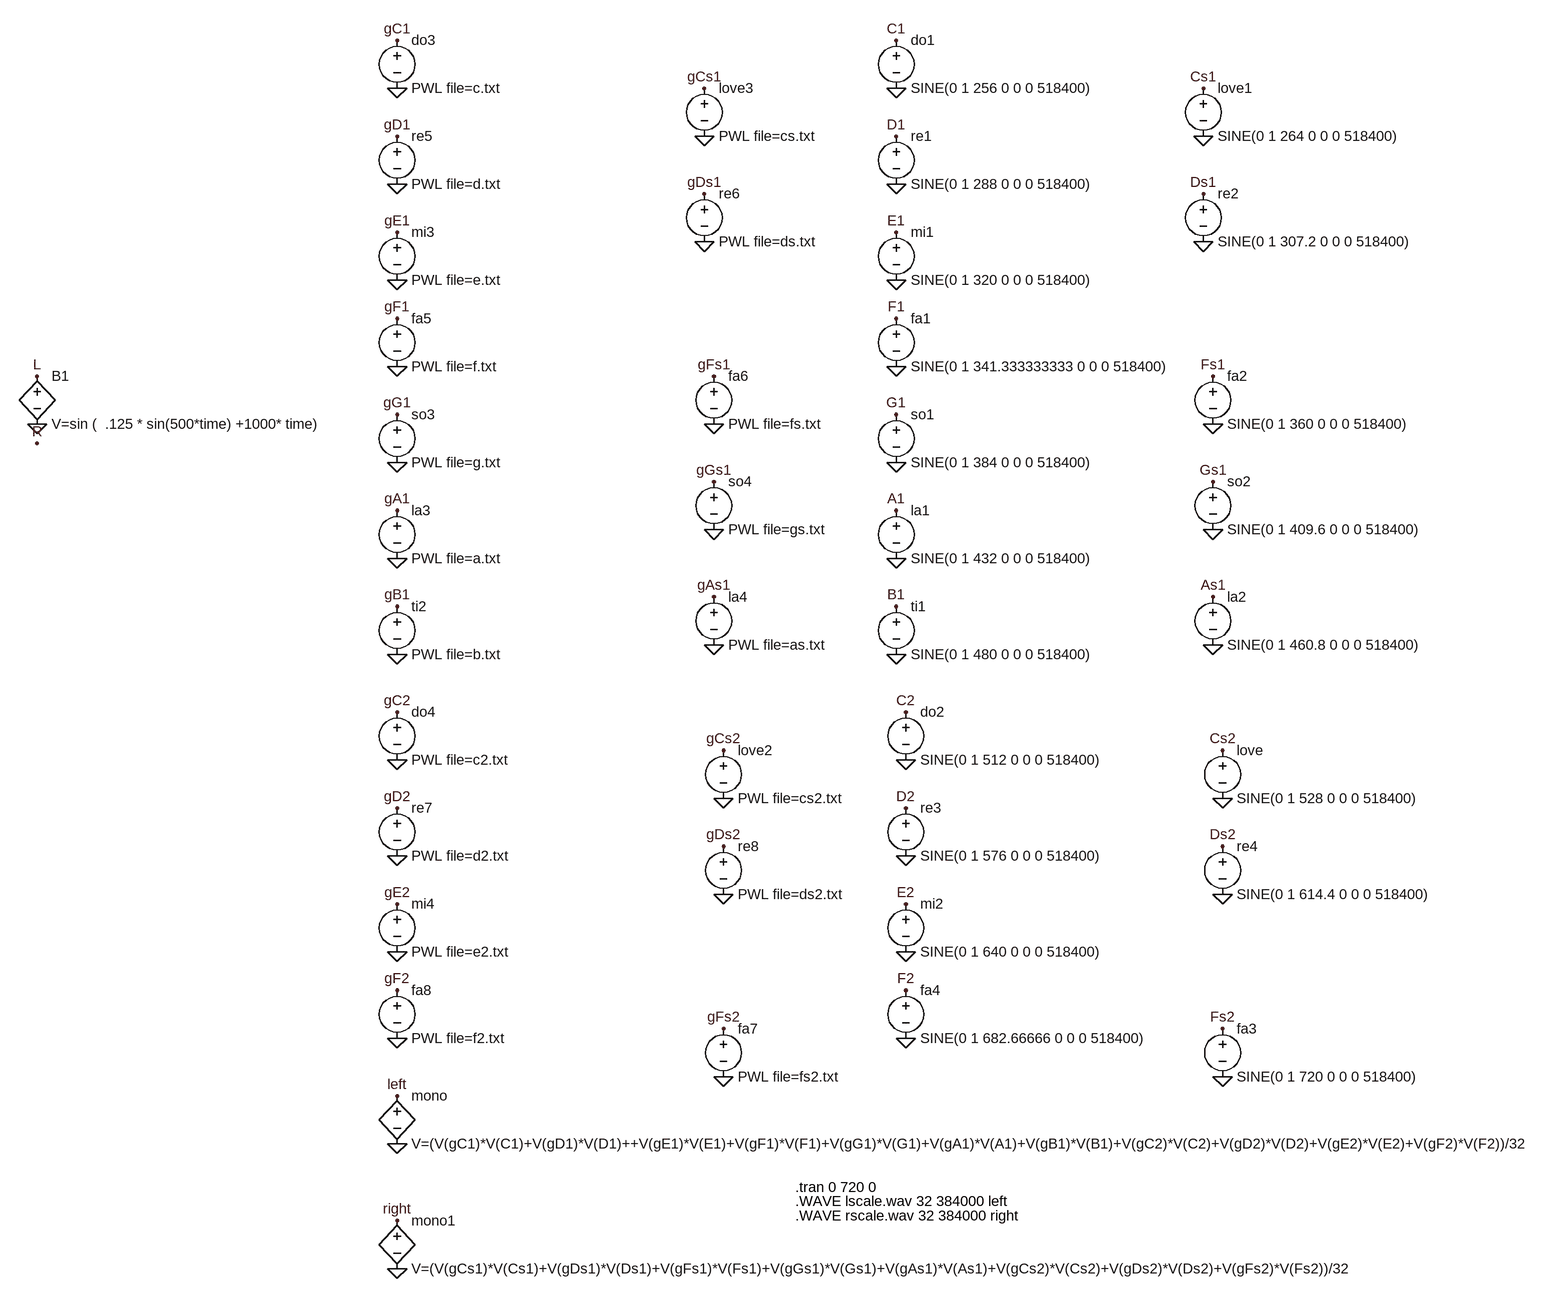
[diagram p0: schematic oneChord.asc]
oneChord.asc, the LTspice schematic file:
Version 4
SHEET 1 6640 1876
FLAG -1952 -992 0
FLAG -1952 -1072 C1
FLAG -1952 -912 D1
FLAG -1952 -672 0
FLAG -1952 -752 E1
FLAG -1952 -608 F1
FLAG -1952 -368 0
FLAG -1952 -448 G1
FLAG -1952 -288 A1
FLAG -1952 -48 0
FLAG -1952 -128 B1
FLAG -1952 -832 0
FLAG -1952 -528 0
FLAG -1952 -208 0
FLAG -1408 192 0
FLAG -1408 112 Cs2
FLAG -1440 -816 Ds1
FLAG -1440 -736 0
FLAG -1424 -512 Fs1
FLAG -1424 -432 0
FLAG -1424 -256 0
FLAG -1424 -336 Gs1
FLAG -1424 -144 As1
FLAG -1424 -64 0
FLAG -1440 -912 0
FLAG -1440 -992 Cs1
FLAG -1408 576 Fs2
FLAG -1408 656 0
FLAG -1936 128 0
FLAG -1936 48 C2
FLAG -1936 208 D2
FLAG -1936 448 0
FLAG -1936 368 E2
FLAG -1936 512 F2
FLAG -1936 288 0
FLAG -1936 592 0
FLAG -1408 272 Ds2
FLAG -1408 352 0
FLAG -2784 -992 0
FLAG -2784 -1072 gC1
FLAG -2784 -912 gD1
FLAG -2784 -672 0
FLAG -2784 -752 gE1
FLAG -2784 -608 gF1
FLAG -2784 -368 0
FLAG -2784 -448 gG1
FLAG -2784 -288 gA1
FLAG -2784 -48 0
FLAG -2784 -128 gB1
FLAG -2784 -832 0
FLAG -2784 -528 0
FLAG -2784 -208 0
FLAG -2240 192 0
FLAG -2240 112 gCs2
FLAG -2272 -816 gDs1
FLAG -2272 -736 0
FLAG -2256 -512 gFs1
FLAG -2256 -432 0
FLAG -2256 -256 0
FLAG -2256 -336 gGs1
FLAG -2256 -144 gAs1
FLAG -2256 -64 0
FLAG -2272 -912 0
FLAG -2272 -992 gCs1
FLAG -2240 576 gFs2
FLAG -2240 656 0
FLAG -2784 128 0
FLAG -2784 48 gC2
FLAG -2784 208 gD2
FLAG -2784 448 0
FLAG -2784 368 gE2
FLAG -2784 512 gF2
FLAG -2784 288 0
FLAG -2784 592 0
FLAG -2240 272 gDs2
FLAG -2240 352 0
FLAG -2784 768 0
FLAG -2784 688 left
FLAG -2784 976 0
FLAG -2784 896 right
FLAG -4176 -512 L
FLAG -4176 -432 0
FLAG -4176 -400 R
SYMBOL voltage -1952 -1088 R0
WINDOW 123 0 0 Left 0
WINDOW 39 0 0 Left 0
SYMATTR InstName do1
SYMATTR Value SINE(0 1 256 0 0 0 518400)
SYMBOL voltage -1952 -928 R0
WINDOW 123 0 0 Left 0
WINDOW 39 0 0 Left 0
SYMATTR InstName re1
SYMATTR Value SINE(0 1 288 0 0 0 518400)
SYMBOL voltage -1952 -768 R0
WINDOW 123 0 0 Left 0
WINDOW 39 0 0 Left 0
SYMATTR InstName mi1
SYMATTR Value SINE(0 1 320 0 0 0 518400)
SYMBOL voltage -1952 -624 R0
WINDOW 123 0 0 Left 0
WINDOW 39 0 0 Left 0
SYMATTR InstName fa1
SYMATTR Value SINE(0 1 341.333333333 0 0 0 518400)
SYMBOL voltage -1952 -464 R0
WINDOW 123 0 0 Left 0
WINDOW 39 0 0 Left 0
SYMATTR InstName so1
SYMATTR Value SINE(0 1 384 0 0 0 518400)
SYMBOL voltage -1952 -304 R0
WINDOW 123 0 0 Left 0
WINDOW 39 0 0 Left 0
SYMATTR InstName la1
SYMATTR Value SINE(0 1 432 0 0 0 518400)
SYMBOL voltage -1952 -144 R0
WINDOW 123 0 0 Left 0
WINDOW 39 0 0 Left 0
SYMATTR InstName ti1
SYMATTR Value SINE(0 1 480 0 0 0 518400)
SYMBOL voltage -1408 96 R0
WINDOW 123 0 0 Left 0
WINDOW 39 0 0 Left 0
SYMATTR InstName love
SYMATTR Value SINE(0 1 528 0 0 0 518400)
SYMBOL voltage -1440 -832 R0
WINDOW 123 0 0 Left 0
WINDOW 39 0 0 Left 0
SYMATTR InstName re2
SYMATTR Value SINE(0 1 307.2 0 0 0 518400)
SYMBOL voltage -1424 -528 R0
WINDOW 123 0 0 Left 0
WINDOW 39 0 0 Left 0
SYMATTR InstName fa2
SYMATTR Value SINE(0 1 360 0 0 0 518400)
SYMBOL voltage -1424 -352 R0
WINDOW 123 0 0 Left 0
WINDOW 39 0 0 Left 0
SYMATTR InstName so2
SYMATTR Value SINE(0 1 409.6 0 0 0 518400)
SYMBOL voltage -1424 -160 R0
WINDOW 123 0 0 Left 0
WINDOW 39 0 0 Left 0
SYMATTR InstName la2
SYMATTR Value SINE(0 1 460.8 0 0 0 518400)
SYMBOL voltage -1440 -1008 R0
WINDOW 123 0 0 Left 0
WINDOW 39 0 0 Left 0
SYMATTR InstName love1
SYMATTR Value SINE(0 1 264 0 0 0 518400)
SYMBOL voltage -1408 560 R0
WINDOW 123 0 0 Left 0
WINDOW 39 0 0 Left 0
SYMATTR InstName fa3
SYMATTR Value SINE(0 1 720 0 0 0 518400)
SYMBOL voltage -1936 32 R0
WINDOW 123 0 0 Left 0
WINDOW 39 0 0 Left 0
SYMATTR InstName do2
SYMATTR Value SINE(0 1 512 0 0 0 518400)
SYMBOL voltage -1936 192 R0
WINDOW 123 0 0 Left 0
WINDOW 39 0 0 Left 0
SYMATTR InstName re3
SYMATTR Value SINE(0 1 576 0 0 0 518400)
SYMBOL voltage -1936 352 R0
WINDOW 123 0 0 Left 0
WINDOW 39 0 0 Left 0
SYMATTR InstName mi2
SYMATTR Value SINE(0 1 640 0 0 0 518400)
SYMBOL voltage -1936 496 R0
WINDOW 123 0 0 Left 0
WINDOW 39 0 0 Left 0
SYMATTR InstName fa4
SYMATTR Value SINE(0 1 682.66666 0 0 0 518400)
SYMBOL voltage -1408 256 R0
WINDOW 123 0 0 Left 0
WINDOW 39 0 0 Left 0
SYMATTR InstName re4
SYMATTR Value SINE(0 1 614.4 0 0 0 518400)
SYMBOL bv -2784 672 R0
SYMATTR InstName mono
SYMATTR Value V=(V(gC1)*V(C1)+V(gD1)*V(D1)++V(gE1)*V(E1)+V(gF1)*V(F1)+V(gG1)*V(G1)+V(gA1)*V(A1)+V(gB1)*V(B1)+V(gC2)*V(C2)+V(gD2)*V(D2)+V(gE2)*V(E2)+V(gF2)*V(F2))/32
SYMBOL voltage -2784 -1088 R0
WINDOW 123 0 0 Left 0
WINDOW 39 0 0 Left 0
SYMATTR InstName do3
SYMATTR Value PWL file=c.txt
SYMBOL voltage -2784 -928 R0
WINDOW 123 0 0 Left 0
WINDOW 39 0 0 Left 0
SYMATTR InstName re5
SYMATTR Value PWL file=d.txt
SYMBOL voltage -2784 -768 R0
WINDOW 123 0 0 Left 0
WINDOW 39 0 0 Left 0
SYMATTR InstName mi3
SYMATTR Value PWL file=e.txt
SYMBOL voltage -2784 -624 R0
WINDOW 123 0 0 Left 0
WINDOW 39 0 0 Left 0
SYMATTR InstName fa5
SYMATTR Value PWL file=f.txt
SYMBOL voltage -2784 -464 R0
WINDOW 123 0 0 Left 0
WINDOW 39 0 0 Left 0
SYMATTR InstName so3
SYMATTR Value PWL file=g.txt
SYMBOL voltage -2784 -304 R0
WINDOW 123 0 0 Left 0
WINDOW 39 0 0 Left 0
SYMATTR InstName la3
SYMATTR Value PWL file=a.txt
SYMBOL voltage -2784 -144 R0
WINDOW 123 0 0 Left 0
WINDOW 39 0 0 Left 0
SYMATTR InstName ti2
SYMATTR Value PWL file=b.txt
SYMBOL voltage -2240 96 R0
WINDOW 123 0 0 Left 0
WINDOW 39 0 0 Left 0
SYMATTR InstName love2
SYMATTR Value PWL file=cs2.txt
SYMBOL voltage -2272 -832 R0
WINDOW 123 0 0 Left 0
WINDOW 39 0 0 Left 0
SYMATTR InstName re6
SYMATTR Value PWL file=ds.txt
SYMBOL voltage -2256 -528 R0
WINDOW 123 0 0 Left 0
WINDOW 39 0 0 Left 0
SYMATTR InstName fa6
SYMATTR Value PWL file=fs.txt
SYMBOL voltage -2256 -352 R0
WINDOW 123 0 0 Left 0
WINDOW 39 0 0 Left 0
SYMATTR InstName so4
SYMATTR Value PWL file=gs.txt
SYMBOL voltage -2256 -160 R0
WINDOW 123 0 0 Left 0
WINDOW 39 0 0 Left 0
SYMATTR InstName la4
SYMATTR Value PWL file=as.txt
SYMBOL voltage -2272 -1008 R0
WINDOW 123 0 0 Left 0
WINDOW 39 0 0 Left 0
SYMATTR InstName love3
SYMATTR Value PWL file=cs.txt
SYMBOL voltage -2240 560 R0
WINDOW 123 0 0 Left 0
WINDOW 39 0 0 Left 0
SYMATTR InstName fa7
SYMATTR Value PWL file=fs2.txt
SYMBOL voltage -2784 32 R0
WINDOW 123 0 0 Left 0
WINDOW 39 0 0 Left 0
SYMATTR InstName do4
SYMATTR Value PWL file=c2.txt
SYMBOL voltage -2784 192 R0
WINDOW 123 0 0 Left 0
WINDOW 39 0 0 Left 0
SYMATTR InstName re7
SYMATTR Value PWL file=d2.txt
SYMBOL voltage -2784 352 R0
WINDOW 123 0 0 Left 0
WINDOW 39 0 0 Left 0
SYMATTR InstName mi4
SYMATTR Value PWL file=e2.txt
SYMBOL voltage -2784 496 R0
WINDOW 123 0 0 Left 0
WINDOW 39 0 0 Left 0
SYMATTR InstName fa8
SYMATTR Value PWL file=f2.txt
SYMBOL voltage -2240 256 R0
WINDOW 123 0 0 Left 0
WINDOW 39 0 0 Left 0
SYMATTR InstName re8
SYMATTR Value PWL file=ds2.txt
SYMBOL bv -2784 880 R0
SYMATTR InstName mono1
SYMATTR Value V=(V(gCs1)*V(Cs1)+V(gDs1)*V(Ds1)+V(gFs1)*V(Fs1)+V(gGs1)*V(Gs1)+V(gAs1)*V(As1)+V(gCs2)*V(Cs2)+V(gDs2)*V(Ds2)+V(gFs2)*V(Fs2))/32
SYMBOL bv -4176 -528 R0
SYMATTR InstName B1
SYMATTR Value V=sin (  .125 * sin(500*time) +1000* time)
TEXT -2120 840 Left 2 !.tran 0 720 0
TEXT -2120 864 Left 2 !.WAVE lscale.wav 32 384000 left
TEXT -2120 888 Left 2 !.WAVE rscale.wav 32 384000 right

The netlist it stands for:
* oneChord.asc
V§do1 C1 0 SINE(0 1 256 0 0 0 518400)
V§re1 D1 0 SINE(0 1 288 0 0 0 518400)
V§mi1 E1 0 SINE(0 1 320 0 0 0 518400)
V§fa1 F1 0 SINE(0 1 341.333333333 0 0 0 518400)
V§so1 G1 0 SINE(0 1 384 0 0 0 518400)
V§la1 A1 0 SINE(0 1 432 0 0 0 518400)
V§ti1 B1 0 SINE(0 1 480 0 0 0 518400)
V§love Cs2 0 SINE(0 1 528 0 0 0 518400)
V§re2 Ds1 0 SINE(0 1 307.2 0 0 0 518400)
V§fa2 Fs1 0 SINE(0 1 360 0 0 0 518400)
V§so2 Gs1 0 SINE(0 1 409.6 0 0 0 518400)
V§la2 As1 0 SINE(0 1 460.8 0 0 0 518400)
V§love1 Cs1 0 SINE(0 1 264 0 0 0 518400)
V§fa3 Fs2 0 SINE(0 1 720 0 0 0 518400)
V§do2 C2 0 SINE(0 1 512 0 0 0 518400)
V§re3 D2 0 SINE(0 1 576 0 0 0 518400)
V§mi2 E2 0 SINE(0 1 640 0 0 0 518400)
V§fa4 F2 0 SINE(0 1 682.66666 0 0 0 518400)
V§re4 Ds2 0 SINE(0 1 614.4 0 0 0 518400)
B§mono left 0 V=(V(gC1)*V(C1)+V(gD1)*V(D1)++V(gE1)*V(E1)+V(gF1)*V(F1)+V(gG1)*V(G1)+V(gA1)*V(A1)+V(gB1)*V(B1)+V(gC2)*V(C2)+V(gD2)*V(D2)+V(gE2)*V(E2)+V(gF2)*V(F2))/32
V§do3 gC1 0 PWL file=c.txt
V§re5 gD1 0 PWL file=d.txt
V§mi3 gE1 0 PWL file=e.txt
V§fa5 gF1 0 PWL file=f.txt
V§so3 gG1 0 PWL file=g.txt
V§la3 gA1 0 PWL file=a.txt
V§ti2 gB1 0 PWL file=b.txt
V§love2 gCs2 0 PWL file=cs2.txt
V§re6 gDs1 0 PWL file=ds.txt
V§fa6 gFs1 0 PWL file=fs.txt
V§so4 gGs1 0 PWL file=gs.txt
V§la4 gAs1 0 PWL file=as.txt
V§love3 gCs1 0 PWL file=cs.txt
V§fa7 gFs2 0 PWL file=fs2.txt
V§do4 gC2 0 PWL file=c2.txt
V§re7 gD2 0 PWL file=d2.txt
V§mi4 gE2 0 PWL file=e2.txt
V§fa8 gF2 0 PWL file=f2.txt
V§re8 gDs2 0 PWL file=ds2.txt
B§mono1 right 0 V=(V(gCs1)*V(Cs1)+V(gDs1)*V(Ds1)+V(gFs1)*V(Fs1)+V(gGs1)*V(Gs1)+V(gAs1)*V(As1)+V(gCs2)*V(Cs2)+V(gDs2)*V(Ds2)+V(gFs2)*V(Fs2))/32
B1 L 0 V=sin (  .125 * sin(500*time) +1000* time)
.tran 0 720 0
.WAVE lscale.wav 32 384000 left
.WAVE rscale.wav 32 384000 right
.backanno
.end